# EAGLE design 3_RS232 (EAGLE 7.6.0)
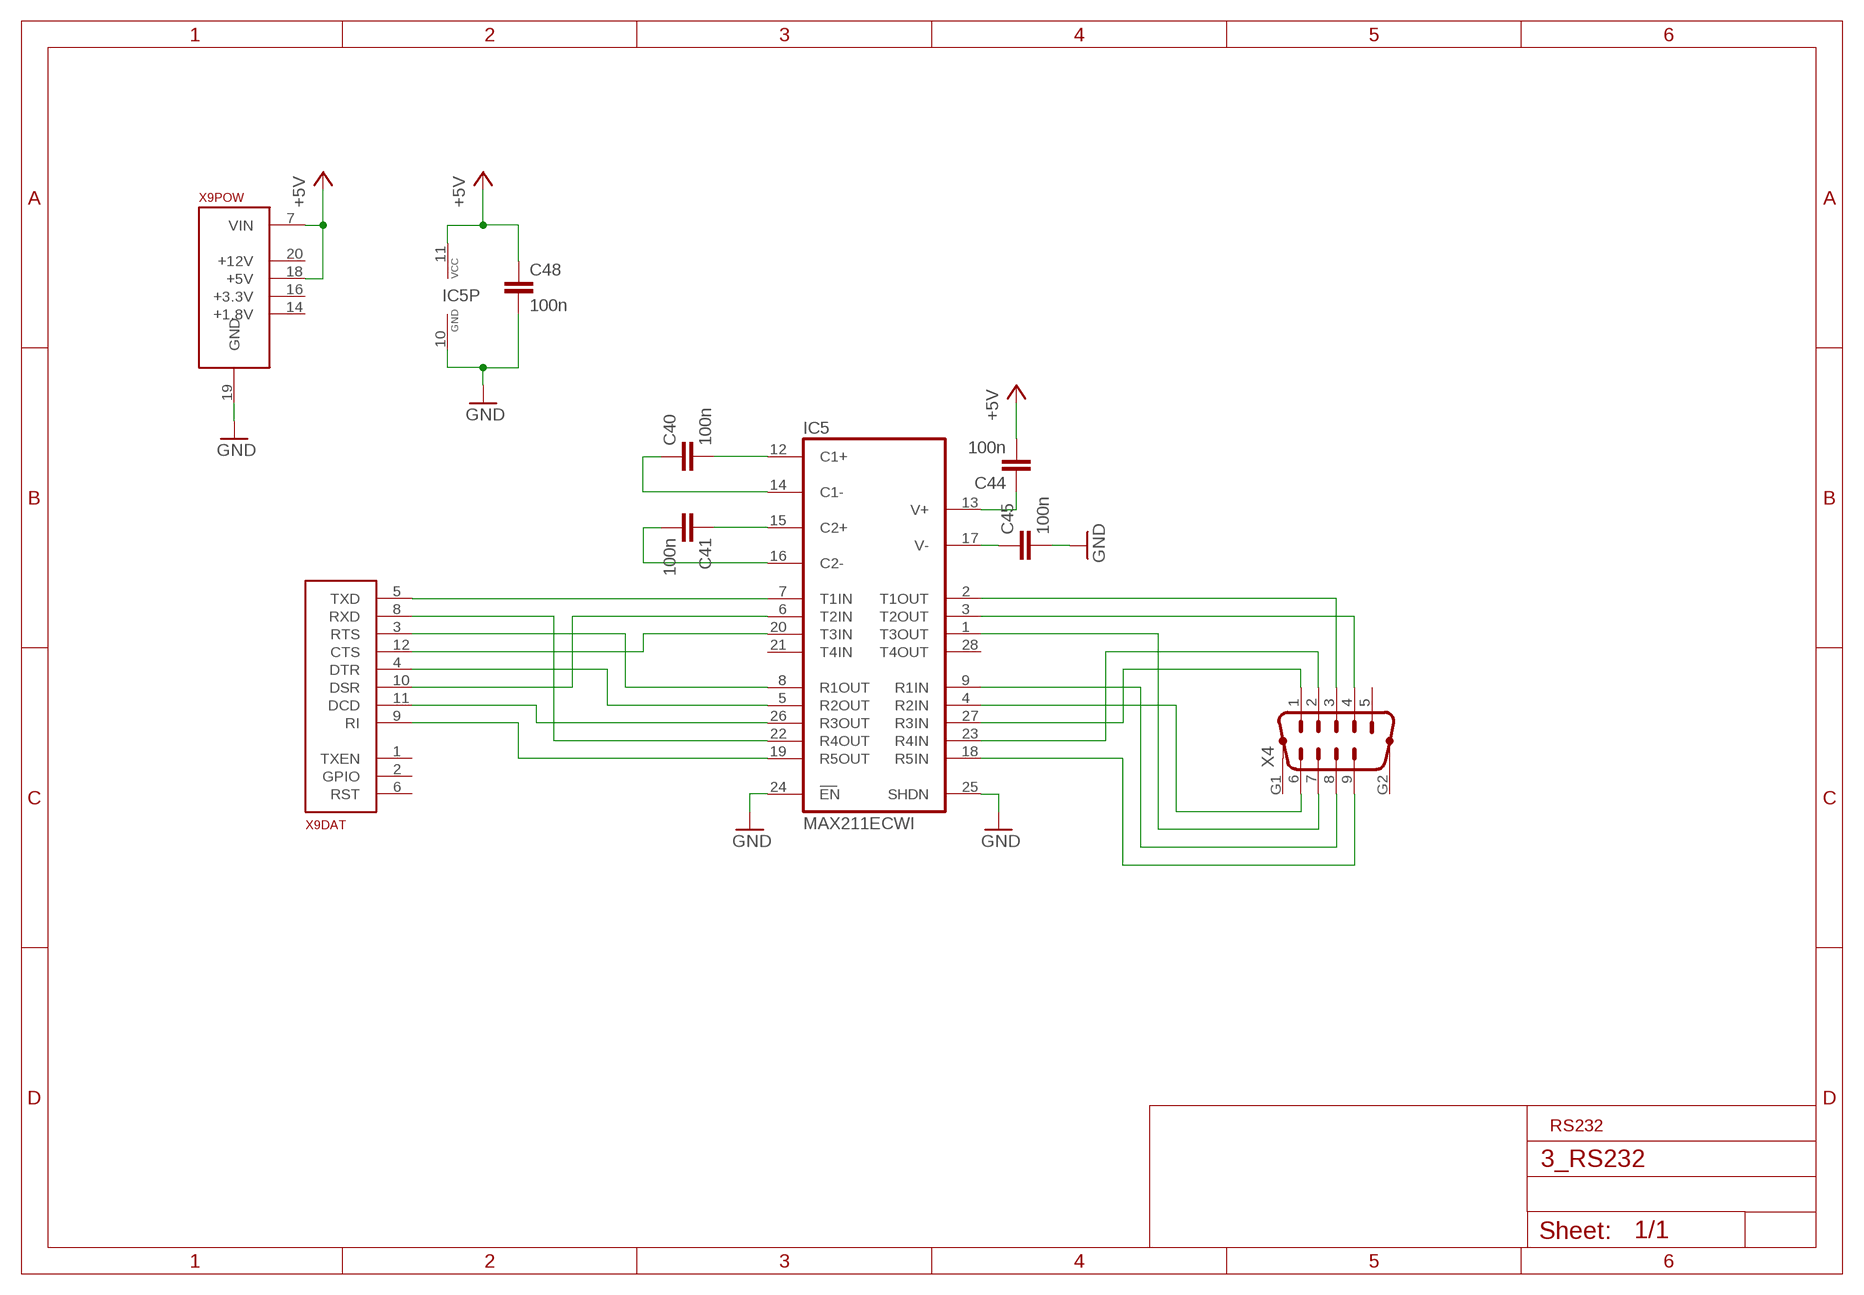
[diagram p0: schematic, sheet 1]

## Parts
C40  100n  C-EUC0805  [C0805]
C41  100n  C-EUC0805  [C0805]
C44  100n  C-EUC0805  [C0805]
C45  100n  C-EUC0805  [C0805]
C48  100n  C-EUC0805  [C0805]
IC5  MAX211ECWI  [SO28L]
X4  M09HP  [M09HP]
X9  ALLSERIALD  [DAUGHTER-THT]

## Nets
+5V: C44.2 C48.1 IC5.11(VCC) X9.7(POW:VIN) X9.18(POW:+5V)
GND: C45.2 C48.2 IC5.10(GND) IC5.24(EN) IC5.25(SHDN) X9.19(POW:GND)
N$9: IC5.18(R5IN) X4.9
N$12: IC5.9(R1IN) X4.8
N$15: IC5.1(T3OUT) X4.7
N$16: IC5.4(R2IN) X4.6
N$17: IC5.27(R3IN) X4.1
N$18: IC5.23(R4IN) X4.2
N$23: IC5.2(T1OUT) X4.3
N$24: IC5.3(T2OUT) X4.4
N$25: C40.2 IC5.12(C1+)
N$26: C40.1 IC5.14(C1-)
N$27: C41.1 IC5.15(C2+)
N$30: C45.1 IC5.17(V-)
N$31: C44.1 IC5.13(V+)
N$92: C41.2 IC5.16(C2-)
N$93: IC5.7(T1IN) X9.5(DAT:TXD)
N$94: IC5.22(R4OUT) X9.8(DAT:RXD)
N$95: IC5.20(T3IN) X9.12(DAT:CTS)
N$96: IC5.8(R1OUT) X9.3(DAT:RTS)
N$97: IC5.26(R3OUT) X9.11(DAT:DCD)
N$98: IC5.19(R5OUT) X9.9(DAT:RI)
N$99: IC5.5(R2OUT) X9.4(DAT:DTR)
N$100: IC5.6(T2IN) X9.10(DAT:DSR)
Unconnected: IC5.21(T4IN) IC5.28(T4OUT) X4.5 X4.G1 X4.G2 X9.1(DAT:TXEN) X9.2(DAT:GPIO) X9.6(DAT:RST) X9.14(POW:+1.8V) X9.16(POW:+3.3V) X9.20(POW:+12V)

## Notes on the sheet
- RS232

## Library data of the parts
C40 C41 C44 C45 C48 = rcl:C-EU: CAPACITOR, European symbol
IC5 = maxim:MAX211ECWI: RS232 TRANSCEIVER; MPN: MAX211ECWI+T; OC_FARNELL: unknown; OC_NEWARK: 67K4400
X4 = con-subd:M09HP: SUB-D; OC_FARNELL: unknown; OC_NEWARK: unknown
X9 = AllSerial:ALLSERIAL

## Board
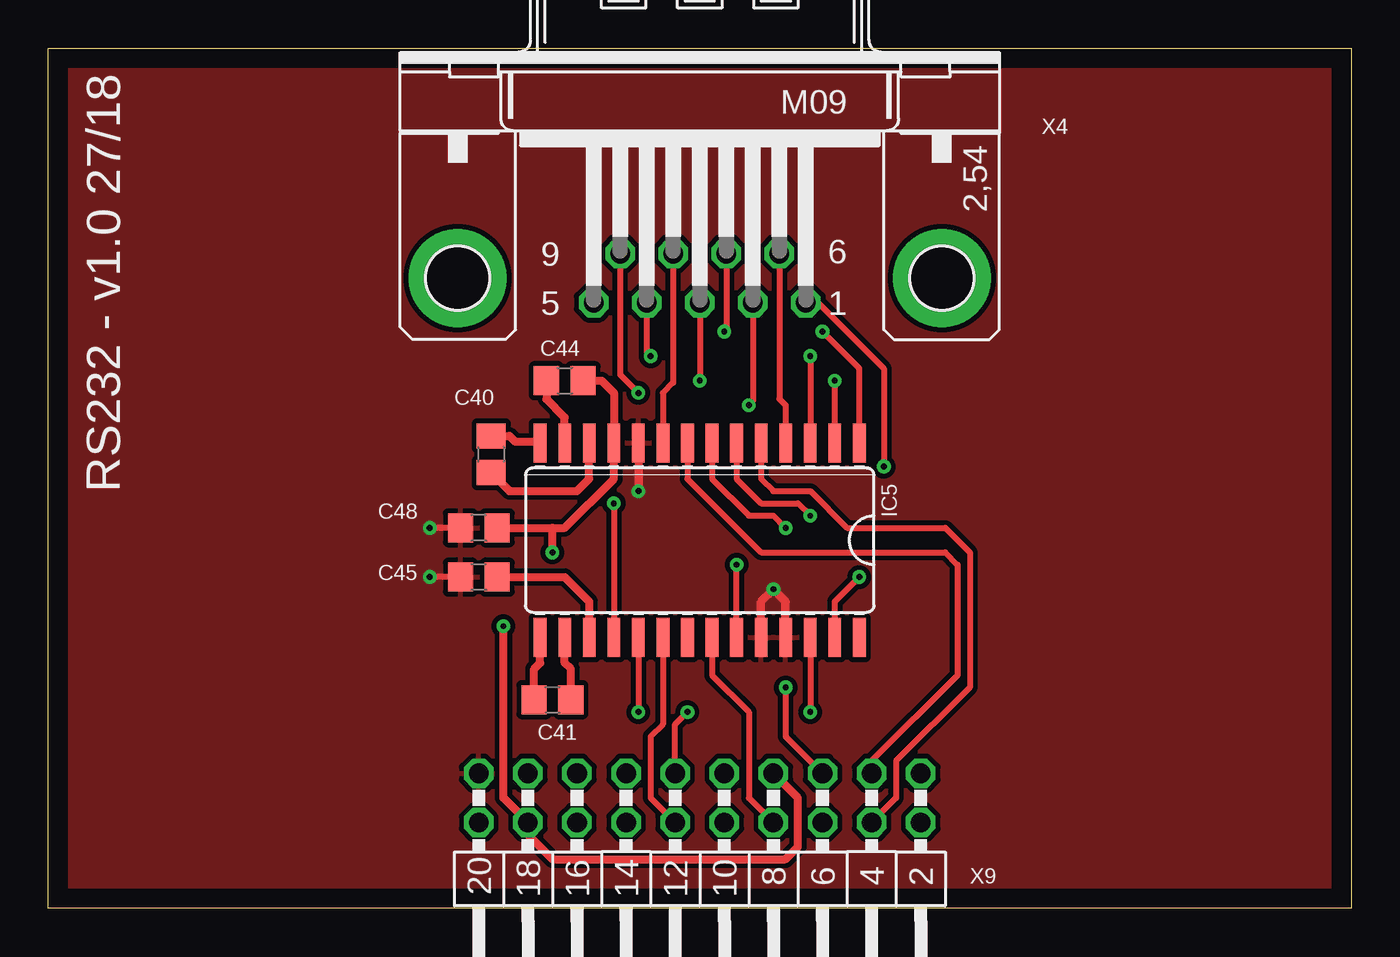
[diagram p1: board, top side]
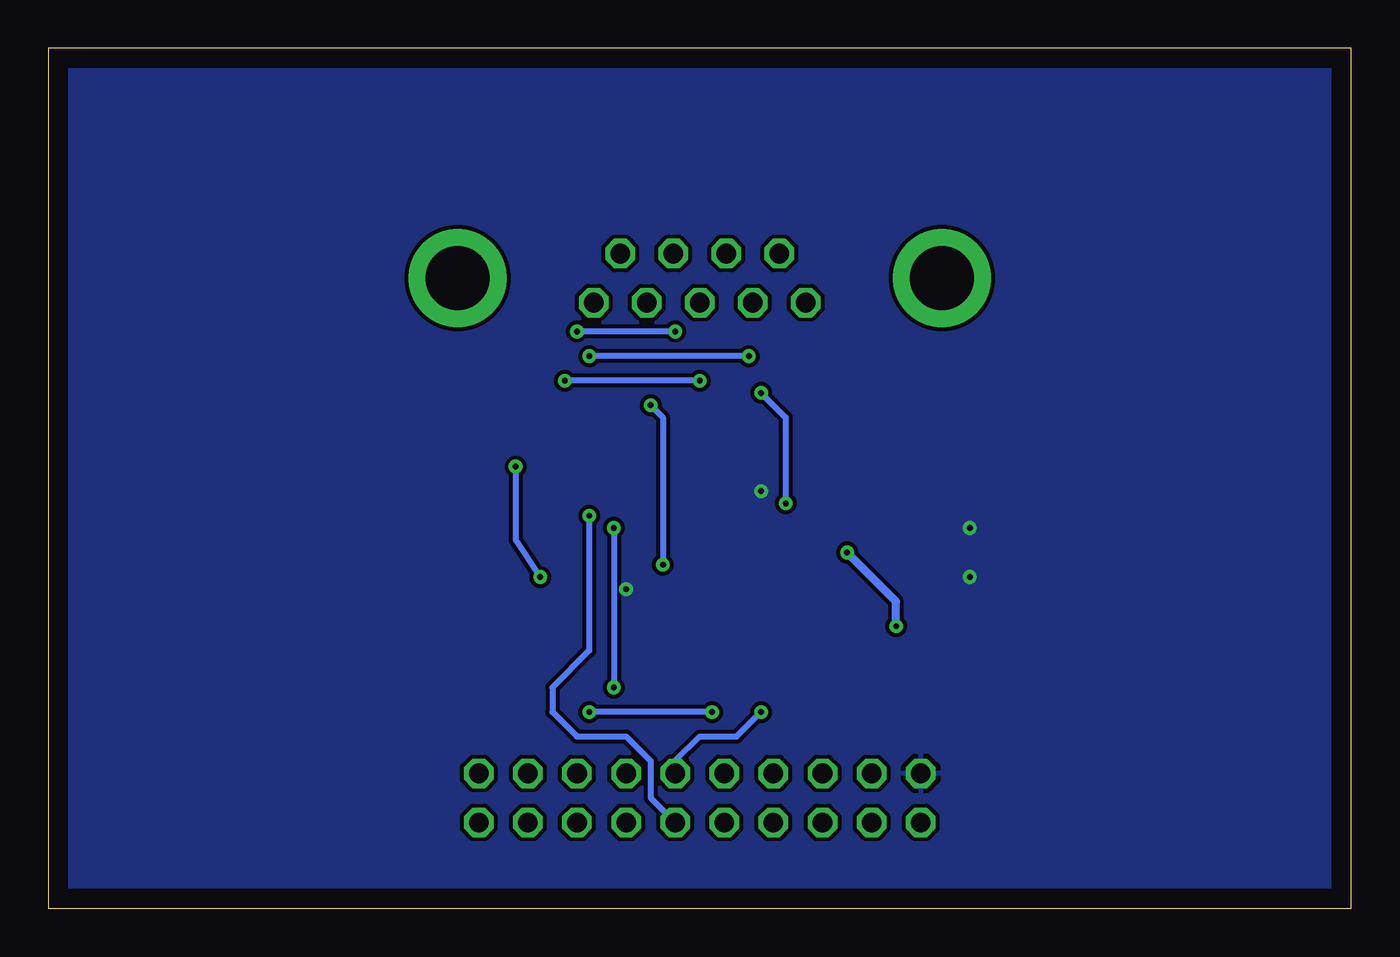
[diagram p2: board, bottom side, seen from below]

Size 67.4 x 44.5 mm. Coordinates in mm from the lower left corner, seen from the top.
Copper layers (1*16): Top 0.035mm / dielectric 1.5mm / Bottom 0.035mm
Design rules "default *": minimum track width 10mil, minimum drill 24mil, track to track 8mil, track to pad 8mil, pad to pad 8mil, via to via 8mil, smd to smd 8mil, copper to edge 40mil, drill to drill 8mil, minimum pad ring 10mil, minimum via ring 8mil, stop-mask expansion 4mil, vias tented up to drill 0.3mm, thermal gap 10mil

### Footprints (pad centres in the part's own frame; a part is rotated, then mirrored left to right if it is on the bottom)
C0805 = smd 1.3 x 1.5: 1 -0.95,0; 2 0.95,0
SO28L = smd 0.66 x 2.032: 1 -8.255,-5.029; 2 -6.985,-5.029; 3 -5.715,-5.029; 4 -4.445,-5.029; 5 -3.175,-5.029; 6 -1.905,-5.029; 7 -0.635,-5.029; 8 0.635,-5.029; 9 1.905,-5.029; 10 3.175,-5.029; 11 4.445,-5.029; 12 5.715,-5.029; 13 6.985,-5.029; 14 8.255,-5.029; 15 8.255,5.029; 16 6.985,5.029; 17 5.715,5.029; 18 4.445,5.029; 19 3.175,5.029; 20 1.905,5.029; 21 0.635,5.029; 22 -0.635,5.029; 23 -1.905,5.029; 24 -3.175,5.029; 25 -4.445,5.029; 26 -5.715,5.029; 27 -6.985,5.029; 28 -8.255,5.029
M09HP = drill 1.016 octagon: 1 -5.486,1.27; 2 -2.743,1.27; 3 0,1.27; 4 2.743,1.27; 5 5.486,1.27; 6 -4.115,-1.27; 7 -1.372,-1.27; 8 1.372,-1.27; 9 4.115,-1.27 | drill 3.302 pad 5.08: G1 -12.522,0; G2 12.522,0
DAUGHTER-THT = drill 1.016 octagon: 1 11.43,6.985; 2 11.43,4.445; 3 8.89,6.985; 4 8.89,4.445; 5 6.35,6.985; 6 6.35,4.445; 7 3.81,6.985; 8 3.81,4.445; 9 1.27,6.985; 10 1.27,4.445; 11 -1.27,6.985; 12 -1.27,4.445; 13 -3.81,6.985; 14 -3.81,4.445; 15 -6.35,6.985; 16 -6.35,4.445; 17 -8.89,6.985; 18 -8.89,4.445; 19 -11.43,6.985; 20 -11.43,4.445

### Placement (x,y rotation side)
C40  22.91,23.5 270 top
C41  26.08,10.79 0 top
C44  26.72,27.3 0 top
C45  22.27,17.14 180 top
C48  22.27,19.68 180 top
IC5  33.7,19.05 180 top
X4  33.7,32.61 180 top
X9  33.7,0 0 top

### Tracks (layer width: path | path; a pad name or v marks a point on that pad's centre or on a via)
+5V  (via drill 0.3)
  Top 0.406: C48.1 26.08,19.68 | 26.08,19.68 26.72,19.68 29.26,22.23 IC5.11 29.26,26.67 28.62,27.3 C44.2 | X9.7 38.78,5.71 38.78,3.17 38.15,2.54 26.08,2.54 24.81,3.81 X9.18 23.54,5.71 v23.54,14.61 | v26.08,18.41 26.08,19.68
  Bottom 0.406: v23.54,14.61 23.54,15.88 v26.08,18.41
GND  (via drill 0.3)
  Top 0.305: C48.2 v19.73,19.68 | C45.2 v19.73,17.14
  Top 0.406: IC5.10 v30.53,21.59 | IC5.24 36.88,15.88 v37.51,16.51 38.15,15.88 IC5.25
  pour Bottom: -0.59,0 67.99,0 67.99,44.45 -0.59,44.45
  pour Top (isolate 0.254): -0.59,44.45 67.99,44.45 67.99,0 -0.59,0
N$9  (via drill 0.3)
  Top 0.305: X4.9 29.59,27.61 v30.53,26.67 | v29.26,20.95 IC5.18
  Bottom 0.305: v30.53,26.67 29.26,25.4 v29.26,20.95
N$12
  Top 0.305: X4.8 32.33,27.2 31.8,26.67 IC5.9
N$15  (via drill 0.3)
  Top 0.305: X4.7 35.07,29.95 v34.97,29.84 | IC5.1 41.96,27.94 v40.05,29.84
  Bottom 0.305: v34.97,29.84 v40.05,29.84
N$16
  Top 0.305: X4.6 37.82,26.36 38.15,26.04 IC5.4
N$17  (via drill 0.3)
  Top 0.305: X4.1 39.83,31.34 43.23,27.94 v43.23,22.86 | IC5.27 40.69,15.88 v41.96,17.14
  Bottom 0.305: v43.23,22.86 43.23,19.05 v41.96,17.14
N$18  (via drill 0.3)
  Top 0.305: X4.2 36.44,26.24 v36.24,26.04 | IC5.23 v35.61,17.78
  Bottom 0.305: v36.24,26.04 35.61,25.4 v35.61,17.78
N$23  (via drill 0.3)
  Top 0.305: X4.3 v33.7,27.3 | IC5.2 v40.69,27.3
  Bottom 0.305: v33.7,27.3 v40.69,27.3
N$24  (via drill 0.3)
  Top 0.305: X4.4 30.96,28.78 v31.16,28.57 | v39.42,28.57 IC5.3
  Bottom 0.305: v31.16,28.57 v39.42,28.57
N$25
  Top 0.406: C40.2 23.86,21.59 27.35,21.59 27.99,22.23 IC5.12
N$26
  Top 0.305: IC5.14 25.39,24.13
  Top 0.406: 25.39,24.13 24.18,24.13 23.86,24.45 C40.1
N$27
  Top 0.406: C41.1 25.13,12.38 25.45,12.7 IC5.15
N$30
  Top 0.406: C45.1 26.72,17.14 27.99,15.88 IC5.17
N$31
  Top 0.406: IC5.13 26.72,25.4 25.77,26.35 C44.1
N$92
  Top 0.406: IC5.16 26.72,12.7 27.03,12.38 C41.2
N$93  (via drill 0.3)
  Top 0.305: IC5.7 34.34,22.23 36.24,20.32 37.51,20.32 v38.15,19.68 | v38.15,11.43 38.15,8.89 X9.5
  Bottom 0.305: v38.15,19.68 v38.15,11.43
N$94
  Top 0.305: IC5.22 34.34,12.06 36.24,10.16 36.24,5.71 X9.8
N$95
  Top 0.305: IC5.20 31.8,9.53 31.16,8.89 31.16,5.71 X9.12
N$96
  Top 0.305: IC5.8 33.07,22.23 36.88,18.41 46.4,18.41 47.04,17.78 47.04,12.06 42.59,7.62 X9.3
N$97  (via drill 0.3)
  Top 0.305: X9.11 32.43,9.53 v33.07,10.16 | IC5.26 v39.42,10.16
  Bottom 0.305: v33.07,10.16 v39.42,10.16
N$98  (via drill 0.3)
  Top 0.305: IC5.19 v30.53,10.16
  Bottom 0.305: X9.9 34.97,7.62 33.7,8.89 31.8,8.89 v30.53,10.16
N$99
  Top 0.305: IC5.5 36.88,22.23 37.51,21.59 39.42,21.59 41.32,19.68 46.4,19.68 47.67,18.41 47.67,11.43 43.86,7.62 43.86,5.71 X9.4
N$100  (via drill 0.3)
  Top 0.305: IC5.6 35.61,22.23 36.88,20.95 38.78,20.95 v39.42,20.32
  Bottom 0.305: v39.42,20.32 39.42,13.34 41.32,11.43 41.32,10.16 40.05,8.89 37.51,8.89 36.24,7.62 36.24,5.71 X9.10

### Text on the board
tPlace: RS232 - v1.0 27/18